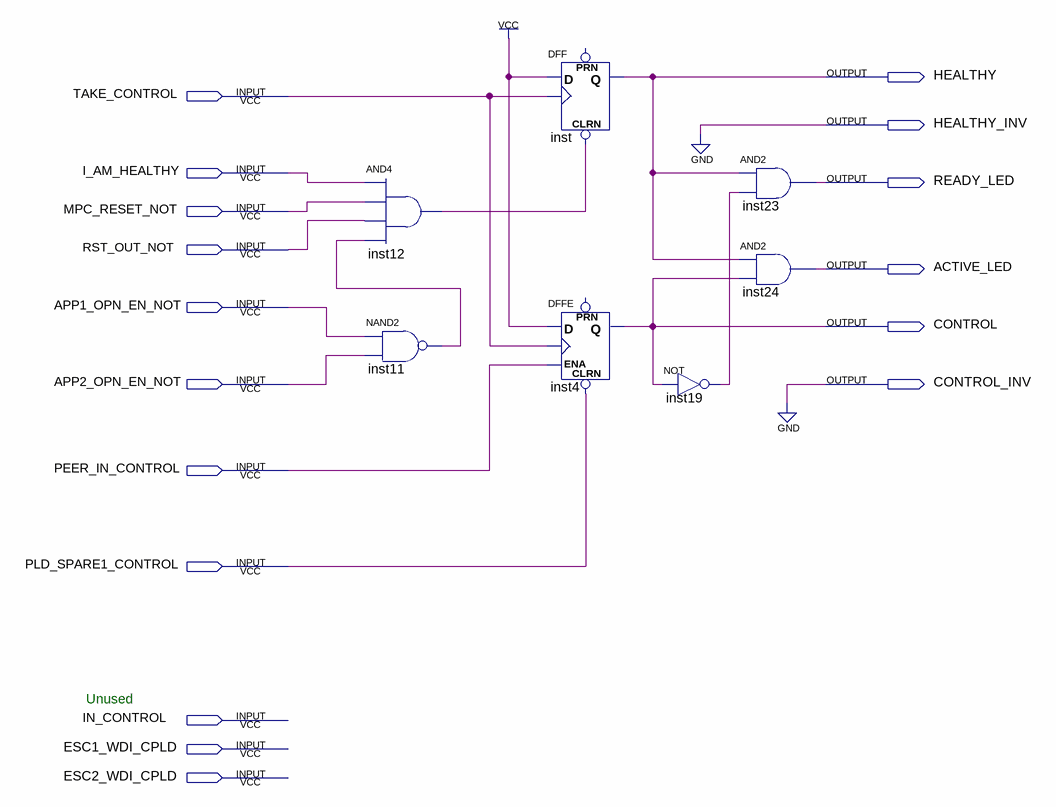
[diagram p0: schematic sheet]
// Quartus schematic HealthyLogic.bdf as structural Verilog: 7 symbols, 17 pins
module HealthyLogic (
  input  TAKE_CONTROL,
  input  I_AM_HEALTHY,
  input  MPC_RESET_NOT,
  input  RST_OUT_NOT,
  input  APP1_OPN_EN_NOT,
  input  APP2_OPN_EN_NOT,
  input  PEER_IN_CONTROL,
  input  PLD_SPARE1_CONTROL,
  input  IN_CONTROL,
  input  ESC1_WDI_CPLD,
  input  ESC2_WDI_CPLD,
  output HEALTHY,
  output HEALTHY_INV,
  output READY_LED,
  output ACTIVE_LED,
  output CONTROL,
  output CONTROL_INV
);

  wire inst11_out, inst12_out, inst19_out;

  and inst12 (inst12_out, I_AM_HEALTHY, MPC_RESET_NOT, RST_OUT_NOT, inst11_out);
  nand inst11 (inst11_out, APP1_OPN_EN_NOT, APP2_OPN_EN_NOT);
  DFF inst (.CLRN(inst12_out), .CLK(TAKE_CONTROL), .D(1'b1), .Q(HEALTHY));  // open: PRN
  DFFE inst4 (
    .CLRN(PLD_SPARE1_CONTROL), .D(1'b1), .CLK(TAKE_CONTROL), .ENA(PEER_IN_CONTROL), .Q(CONTROL));  // open: PRN
  not inst19 (inst19_out, CONTROL);
  and inst23 (READY_LED, HEALTHY, inst19_out);
  and inst24 (ACTIVE_LED, HEALTHY, CONTROL);

  assign CONTROL_INV = 1'b0;
  assign HEALTHY_INV = 1'b0;

  // Notes on the sheet:
  //   Unused
endmodule
